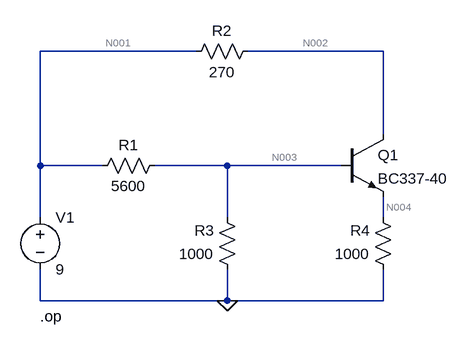
[diagram p0: schematic Circuit 3.asc]
Circuit 3.asc, the LTspice schematic file:
Version 4
SHEET 1 880 680
WIRE 208 32 -32 32
WIRE 496 32 288 32
WIRE 496 160 496 32
WIRE -32 208 -32 32
WIRE 64 208 -32 208
WIRE 256 208 144 208
WIRE 432 208 256 208
WIRE -32 288 -32 208
WIRE 256 288 256 208
WIRE 496 288 496 256
WIRE -32 416 -32 368
WIRE 256 416 256 368
WIRE 256 416 -32 416
WIRE 496 416 496 368
WIRE 496 416 256 416
FLAG 256 416 0
SYMBOL res 160 192 R90
WINDOW 0 0 56 VBottom 2
WINDOW 3 32 56 VTop 2
SYMATTR InstName R1
SYMATTR Value 5600
SYMBOL res 304 16 R90
WINDOW 0 0 56 VBottom 2
WINDOW 3 32 56 VTop 2
SYMATTR InstName R2
SYMATTR Value 270
SYMBOL res 272 384 R180
WINDOW 0 36 76 Left 2
WINDOW 3 36 40 Left 2
SYMATTR InstName R3
SYMATTR Value 1000
SYMBOL res 512 384 R180
WINDOW 0 36 76 Left 2
WINDOW 3 36 40 Left 2
SYMATTR InstName R4
SYMATTR Value 1000
SYMBOL voltage -32 272 R0
WINDOW 123 0 0 Left 0
WINDOW 39 0 0 Left 0
SYMATTR InstName V1
SYMATTR Value 9
SYMBOL npn 432 160 R0
SYMATTR InstName Q1
SYMATTR Value BC337-40
TEXT -32 440 Left 2 !.op

The netlist it stands for:
* Circuit 3.asc
R1 N003 N001 5600
R2 N002 N001 270
R3 0 N003 1000
R4 0 N004 1000
V1 N001 0 9
Q1 N002 N003 N004 0 BC337-40
.model NPN NPN
.model PNP PNP
.lib standard.bjt
.op
.backanno
.end

* Results of the author's LTspice run, read from the files saved beside the schematic
* Operating Point:
*   V(n003) = 1.362 V
*   V(n001) = 9 V
*   V(n002) = 8.792 V
*   V(n004) = 772.4 mV
*   Ic(Q1) = 770.7 µA
*   Ib(Q1) = 1.739 µA
*   Ie(Q1) = -772.4 µA
*   I(R1) = -1.364 mA
*   I(R2) = -770.7 µA
*   I(R3) = -1.362 mA
*   I(R4) = -772.4 µA
*   I(V1) = -2.135 mA
* From the log:
*   Semiconductor Device Operating Points:
*                           --- Bipolar Transistors ---
*   Name:       q1
*   Model:   bc337-40
*   Ib:       1.74e-06
*   Ic:       7.71e-04
*   Vbe:      5.90e-01
*   Vbc:     -7.43e+00
*   Vce:      8.02e+00
*   BetaDC:   4.43e+02
*   Gm:       3.00e-02
*   Rpi:      1.48e+04
*   Rx:       6.88e+01
*   Ro:       1.38e+05
*   Cbe:      9.14e-11
*   Cbc:      1.94e-12
*   Cjs:      0.00e+00
*   BetaAC:   4.44e+02
*   Cbx:      2.32e-12
*   Ft:       4.98e+07